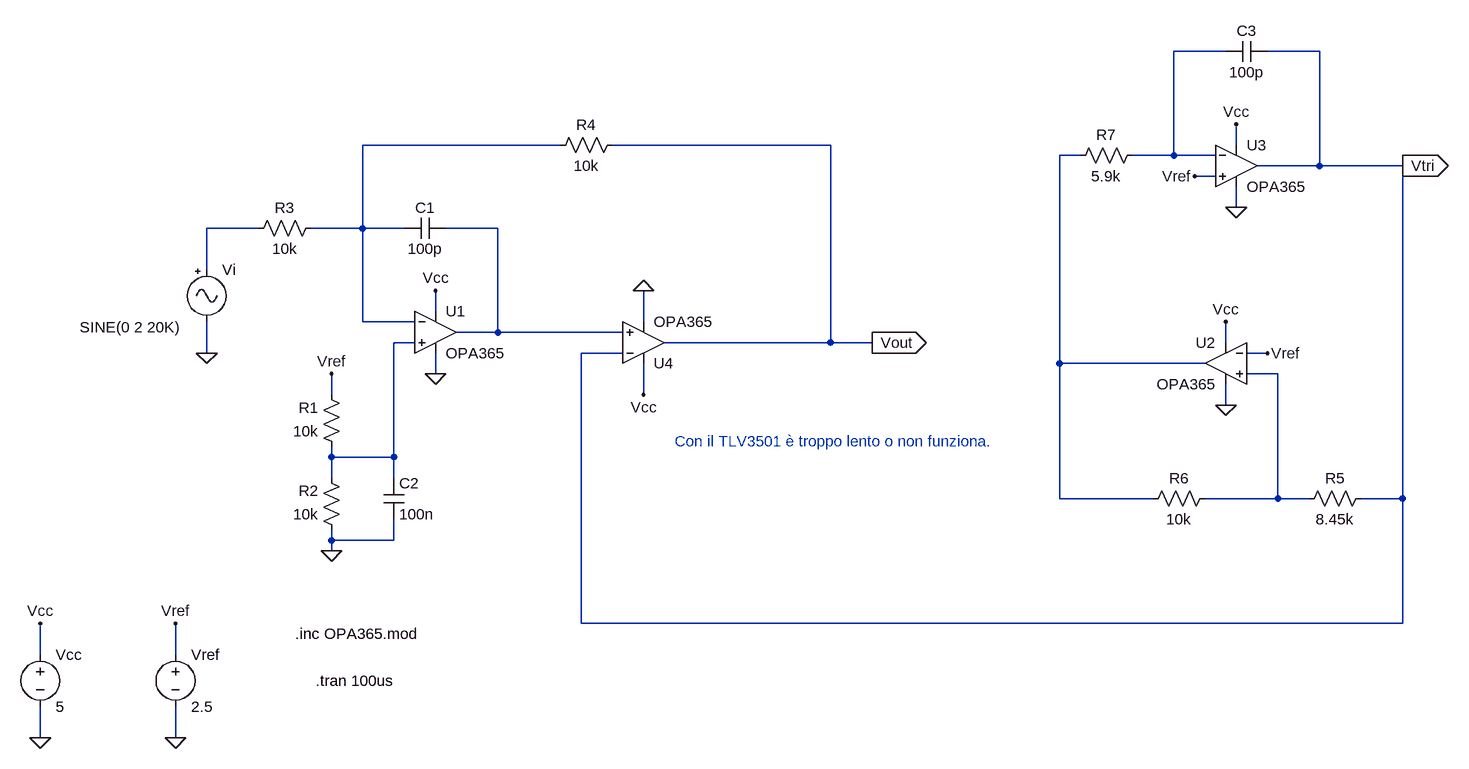
[diagram p0: schematic sboa212_LTSPICE.asc]
sboa212_LTSPICE.asc, the LTspice schematic file:
Version 4
SHEET 1 1684 772
WIRE 1312 -304 1232 -304
WIRE 1456 -304 1376 -304
WIRE 288 -160 -16 -160
WIRE 704 -160 368 -160
WIRE 1328 -160 1328 -192
WIRE 1088 -144 1056 -144
WIRE 1232 -144 1232 -304
WIRE 1232 -144 1168 -144
WIRE 1296 -144 1232 -144
WIRE 1456 -128 1456 -304
WIRE 1456 -128 1360 -128
WIRE 1584 -128 1456 -128
WIRE 1296 -112 1264 -112
WIRE 1328 -64 1328 -96
WIRE -176 -32 -256 -32
WIRE -16 -32 -16 -160
WIRE -16 -32 -96 -32
WIRE 48 -32 -16 -32
WIRE 192 -32 112 -32
WIRE -256 32 -256 -32
WIRE 96 96 96 64
WIRE -16 112 -16 -32
WIRE 64 112 -16 112
WIRE 416 112 416 64
WIRE 192 128 192 -32
WIRE 192 128 128 128
WIRE 384 128 192 128
WIRE 64 144 32 144
WIRE 704 144 704 -160
WIRE 704 144 448 144
WIRE 768 144 704 144
WIRE 1312 144 1312 112
WIRE -256 160 -256 112
WIRE 384 160 320 160
WIRE 1376 160 1344 160
WIRE 1056 176 1056 -144
WIRE 1280 176 1056 176
WIRE 96 192 96 160
WIRE 1392 192 1344 192
WIRE -64 224 -64 192
WIRE 416 224 416 176
WIRE 1312 240 1312 208
WIRE -64 320 -64 304
WIRE 32 320 32 144
WIRE 32 320 -64 320
WIRE -64 352 -64 320
WIRE 32 352 32 320
WIRE 1056 384 1056 176
WIRE 1200 384 1056 384
WIRE 1392 384 1392 192
WIRE 1392 384 1280 384
WIRE 1440 384 1392 384
WIRE 1584 384 1584 -128
WIRE 1584 384 1520 384
WIRE -64 448 -64 432
WIRE 32 448 32 416
WIRE 32 448 -64 448
WIRE -64 464 -64 448
WIRE 320 576 320 160
WIRE 1584 576 1584 384
WIRE 1584 576 320 576
WIRE -512 624 -512 576
WIRE -304 624 -304 576
WIRE -512 752 -512 704
WIRE -304 752 -304 704
FLAG -256 160 0
FLAG -64 464 0
FLAG -64 192 Vref
FLAG -512 752 0
FLAG -512 576 Vcc
FLAG -304 752 0
FLAG -304 576 Vref
FLAG 96 192 0
FLAG 96 64 Vcc
FLAG 416 64 0
FLAG 416 224 Vcc
FLAG 768 144 Vout
IOPIN 768 144 Out
FLAG 1328 -192 Vcc
FLAG 1328 -64 0
FLAG 1264 -112 Vref
FLAG 1376 160 Vref
FLAG 1312 112 Vcc
FLAG 1312 240 0
FLAG 1584 -128 Vtri
IOPIN 1584 -128 Out
SYMBOL Opamps\\opamp2 96 64 R0
SYMATTR InstName U1
SYMATTR Value OPA365
SYMBOL Misc\\signal -256 16 R0
WINDOW 3 -195 104 Left 2
WINDOW 123 0 0 Left 0
WINDOW 39 0 0 Left 0
SYMATTR Value SINE(0 2 20K)
SYMATTR InstName Vi
SYMBOL res -48 320 R180
WINDOW 0 36 76 Left 2
WINDOW 3 36 40 Left 2
SYMATTR InstName R1
SYMATTR Value 10k
SYMATTR SpiceLine tol=1 pwr=1
SYMBOL res -48 448 R180
WINDOW 0 36 76 Left 2
WINDOW 3 36 40 Left 2
SYMATTR InstName R2
SYMATTR Value 10k
SYMATTR SpiceLine tol=1 pwr=1
SYMBOL res -192 -16 R270
WINDOW 0 32 56 VTop 2
WINDOW 3 0 56 VBottom 2
SYMATTR InstName R3
SYMATTR Value 10k
SYMATTR SpiceLine tol=1 pwr=1
SYMBOL cap 16 352 R0
SYMATTR InstName C2
SYMATTR Value 100n
SYMBOL voltage -512 608 R0
WINDOW 123 0 0 Left 0
WINDOW 39 0 0 Left 0
SYMATTR InstName Vcc
SYMATTR Value 5
SYMBOL voltage -304 608 R0
WINDOW 123 0 0 Left 0
WINDOW 39 0 0 Left 0
SYMATTR InstName Vref
SYMATTR Value 2.5
SYMBOL cap 112 -48 R90
WINDOW 0 0 32 VBottom 2
WINDOW 3 32 32 VTop 2
SYMATTR InstName C1
SYMATTR Value 100p
SYMBOL res 272 -144 R270
WINDOW 0 32 56 VTop 2
WINDOW 3 0 56 VBottom 2
SYMATTR InstName R4
SYMATTR Value 10k
SYMATTR SpiceLine tol=1 pwr=1
SYMBOL Opamps\\opamp2 1328 -192 R0
SYMATTR InstName U3
SYMATTR Value OPA365
SYMBOL res 1424 400 R270
WINDOW 0 32 56 VTop 2
WINDOW 3 0 56 VBottom 2
SYMATTR InstName R5
SYMATTR Value 8.45k
SYMATTR SpiceLine tol=1 pwr=1
SYMBOL res 1184 400 R270
WINDOW 0 32 56 VTop 2
WINDOW 3 0 56 VBottom 2
SYMATTR InstName R6
SYMATTR Value 10k
SYMATTR SpiceLine tol=1 pwr=1
SYMBOL res 1072 -128 R270
WINDOW 0 32 56 VTop 2
WINDOW 3 0 56 VBottom 2
SYMATTR InstName R7
SYMATTR Value 5.9k
SYMATTR SpiceLine tol=1 pwr=1
SYMBOL cap 1376 -320 R90
WINDOW 0 0 32 VBottom 2
WINDOW 3 32 32 VTop 2
SYMATTR InstName C3
SYMATTR Value 100p
SYMBOL Opamps\\opamp2 1312 112 M0
SYMATTR InstName U2
SYMATTR Value OPA365
SYMBOL Opamps\\opamp2 416 208 M180
SYMATTR InstName U4
SYMATTR Value OPA365
TEXT -120 592 Left 2 !.inc OPA365.mod
TEXT -88 664 Left 2 !.tran 100us
TEXT 464 296 Left 2 ;Con il TLV3501 è troppo lento o non funziona.

The netlist it stands for:
* sboa212_LTSPICE.asc
XU1 N006 N002 Vcc 0 N005 OPA365  ; pins In+ In- V+ V- OUT
Vi N004 0 SINE(0 2 20K)
R1 N006 Vref 10k tol=1 pwr=1
R2 0 N006 10k tol=1 pwr=1
R3 N004 N002 10k tol=1 pwr=1
C2 N006 0 100n
Vcc Vcc 0 5
Vref Vref 0 2.5
C1 N005 N002 100p
R4 N002 Vout 10k tol=1 pwr=1
XU3 Vref N001 Vcc 0 Vtri OPA365  ; pins In+ In- V+ V- OUT
R5 N007 Vtri 8.45k tol=1 pwr=1
R6 N003 N007 10k tol=1 pwr=1
R7 N003 N001 5.9k tol=1 pwr=1
C3 Vtri N001 100p
XU2 N007 Vref Vcc 0 N003 OPA365  ; pins In+ In- V+ V- OUT
XU4 N005 Vtri Vcc 0 Vout OPA365  ; pins In+ In- V+ V- OUT
.inc OPA365.mod
.tran 100us
* Con il TLV3501 è troppo lento o non funziona.
.backanno
.end